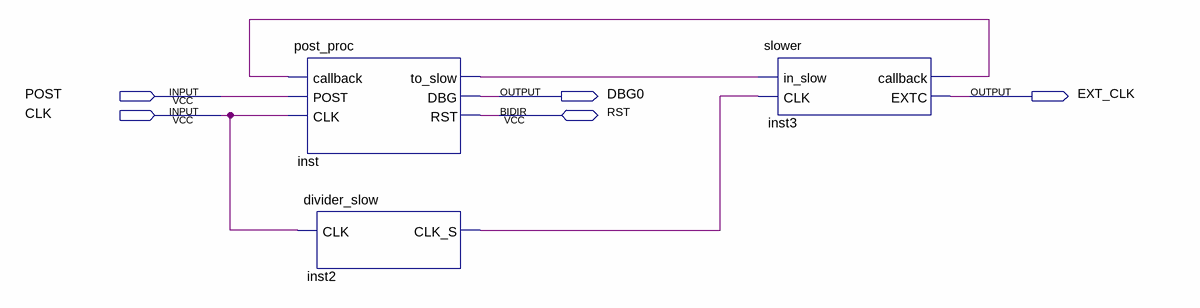
[diagram p0: schematic sheet]
// Quartus schematic ext_clk_main.bdf as structural Verilog: 3 symbols, 5 pins
module ext_clk_main (
  input  POST,
  input  CLK,
  inout  RST,
  output DBG0,
  output EXT_CLK
);

  wire inst2_clk_s, inst3_callback, inst_to_slow;

  post_proc inst (.callback(inst3_callback), .POST(POST), .CLK(CLK), .to_slow(inst_to_slow), .DBG(DBG0), .RST(RST));
  divider_slow inst2 (.CLK(CLK), .CLK_S(inst2_clk_s));
  slower inst3 (.in_slow(inst_to_slow), .CLK(inst2_clk_s), .callback(inst3_callback), .EXTC(EXT_CLK));
endmodule
